# EasyEDA Pro project ProPrj_4进4出_2026-07-01.epro, board PCB1
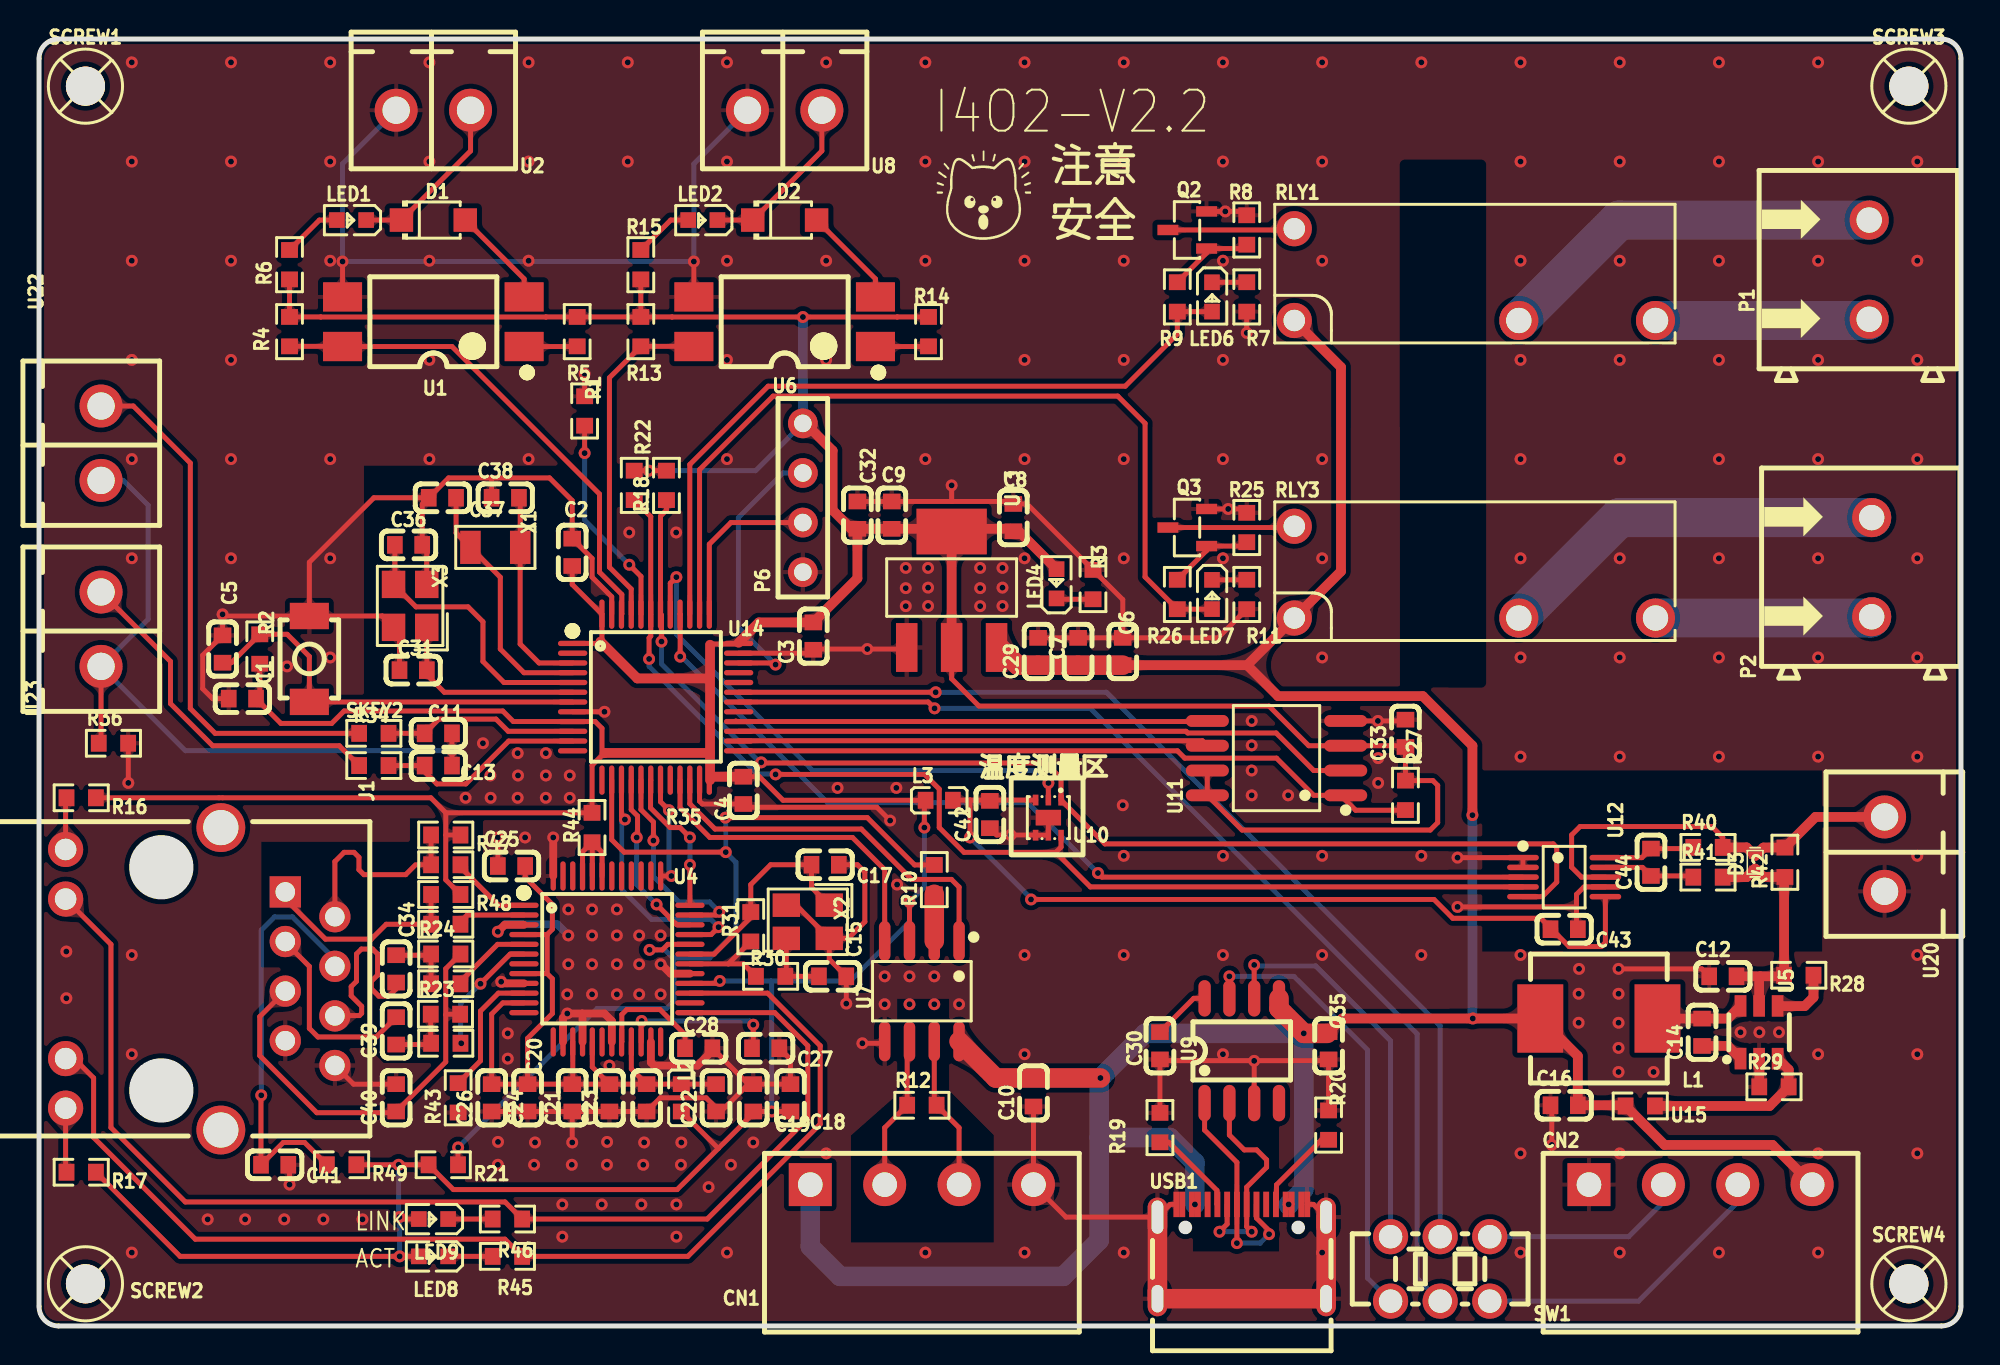
[diagram p3: board, top side]
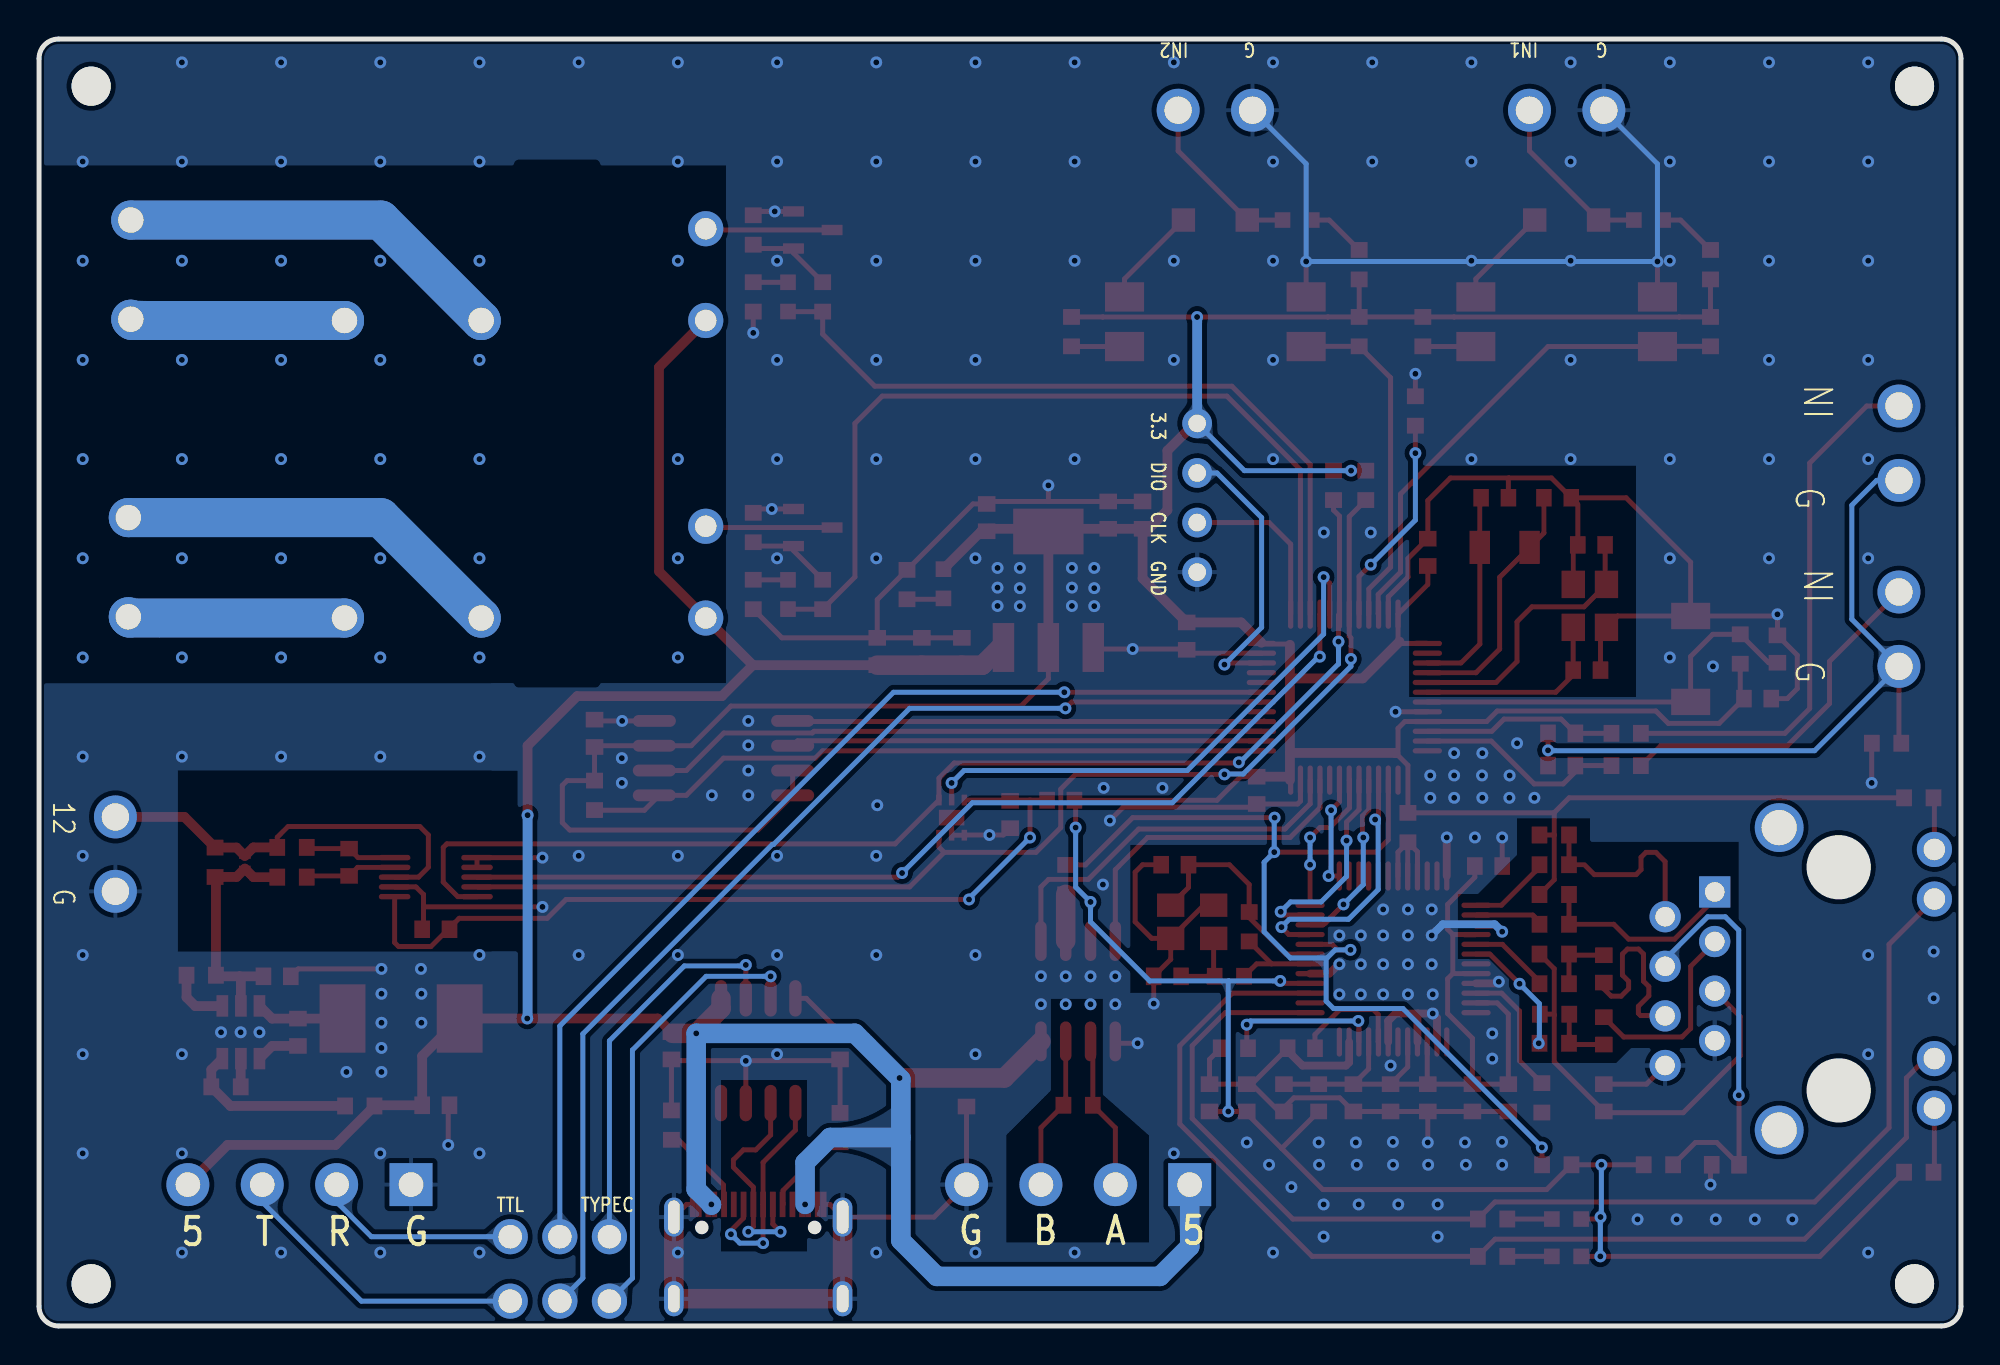
[diagram p4: board, bottom side, seen from below]

Outline 98.42 x 65.91 mm; copper layers: Top Layer, Bottom Layer. Coordinates in mm from the lower left corner of the outline.
Outline path: 0,64.91 0,1 arc(0.29,0.29) 1,0 97.42,0 arc(98.13,0.29) 98.42,1 98.42,64.91 arc(98.13,65.62) 97.42,65.91 1,65.91 arc(0.29,65.62) 0,64.91
Stack: Top Layer 0.035mm / Dielectric1 1.51mm FR4 er 4.5 / Bottom Layer 0.035mm

## Design rules (mm)
net 485_B: DP2
net 485_A: DP2
net TXN: DP3
net TXP: DP3
net RXN: DP4
net RXP: DP4
net $2N96: DP5
net $2N97: DP5
spacing copperThickness1oz (default): track to track 0.102, other pairs 0.152 to 0.3
spacing copperThickness2oz: track to track 0.203, other pairs 0.152 to 0.3
track width copperThickness1oz (default): min 0.127, default 0.254, max 2.54
track width copperThickness2oz: min 0.203, default 0.254, max 2.54
differential pair differentialPair (default): width min 0.127, default 0.254, max 2.54; gap min 0.152, default 0.152
net GND uses copperRegion

## Placement (name value [footprint] x y rotation side)
C1  100nF  [C0603]  10.41 32.13 0 top
C2  100nF  [C0603]  27.3 39.62 270 top
C3  100nF  [C0603]  39.65 35.33 90 top
C4  100nF  [C0603]  36.07 27.43 90 top
C5  100nF  [C0603]  9.4 34.67 270 top
C6  100nF  [C0603]  55.5 34.54 90 top
C7  100nF  [C0603]  53.21 34.54 90 top
C8  100nF  [C0603]  49.89 41.4 270 top
C9  100nF  [C0603]  43.67 41.53 270 top
C10  100nF  [C0603]  50.93 11.94 90 top
C11  100nF  [C0603]  20.45 30.35 0 top
C12  4.7uF  [C0603]  86.23 17.91 0 top
C13  100nF  [C0603]  20.45 28.7 0 top
C14  100nF  [C0603]  85.17 15.04 90 top
C15  18pF  [C0603]  40.64 17.91 180 top
C16  10uF  [C0603]  78.11 11.3 0 top
C17  18pF  [C0603]  40.26 23.62 180 top
C18  100nF  [C0603]  38.48 11.68 270 top
C19  4.7uF  [C0603]  36.58 11.68 270 top
C20  100nF  [C0603]  25.02 11.68 90 top
C21  100nF  [C0603]  29.21 11.68 90 top
C22  100nF  [C0603]  34.67 11.68 90 top
C23  100nF  [C0603]  31.11 11.68 90 top
C24  100nF  [C0603]  27.3 11.68 90 top
C25  100nF  [C0603]  24.2 23.56 0 top
C26  4.7uF  [C0603]  23.18 11.68 90 top
C27  10nF  [C0603]  37.21 14.22 180 top
C28  4.7uF  [C0603]  33.78 14.22 180 top
C29  10uF  [C0603]  51.16 34.54 90 top
C30  100nF  [C0603]  57.4 14.35 270 top
C31  22pF  [C0603]  19.16 33.59 0 top
C32  10uF  [C0603]  41.91 41.53 270 top
C33  100nF  [C0603]  69.98 30.35 90 top
C34  6.8nF  [C0603]  18.29 18.29 270 top
C35  100nF  [C0603]  66.04 14.35 90 top
C36  22pF  [C0603]  18.92 40 180 top
C37  22pF  [C0603]  20.66 42.42 0 top
C38  22pF  [C0603]  23.88 42.42 0 top
C39  6.8nF  [C0603]  18.29 15.11 90 top
C40  10nF  [C0603]  18.29 11.68 90 top
C41  22nF  [C0603]  12.06 8.25 180 top
C42  100nF  [C0603]  48.69 26.19 90 top
C43  100nF  [C0603]  78.11 20.32 180 top
C44  100nF  [C0603]  82.55 23.75 90 top
CN1  WJ15EDGRC-3.81-04P-14-00A  [CONN-TH_WJ15EDGRC-3.81-4P]  45.21 7.24 0 top
CN2  WJ15EDGRC-3.81-04P-14-00A  [CONN-TH_WJ15EDGRC-3.81-4P]  85.09 7.24 0 top
D1  SMF5.0A  [SOD-123FL_L2.7-W1.8-LS3.8-RD]  20.19 56.64 0 top
D2  SMF5.0A  [SOD-123FL_L2.7-W1.8-LS3.8-RD]  38.18 56.64 0 top
D3  H5VL10B  [SOD-882_L1.0-W0.6-BI]  87.88 23.75 90 top
J1  HR911105A  [RJ45-TH_HR911105A]  8.25 17.78 270 top
L1  10uH  [IND-SMD_L7.3-W6.8]  79.88 15.75 180 top
L2  BLM18PG121SN1D  [L0603]  32.89 11.68 90 top
L3  BLM18PG121SN1D  [L0603]  46.1 26.92 0 top
LED1  NCD0603Y2  [LED0603-RD]  16 56.64 180 top
LED2  NCD0603Y2  [LED0603-RD]  33.99 56.64 180 top
LED4  NCD0603Y2  [LED0603-RD]  52.11 38.01 90 top
LED6  NCD0603Y2  [LED0603-RD]  60.07 52.7 270 top
LED7  NCD0603Y2  [LED0603-RD]  60.07 37.47 270 top
LED8  NCD0603Y2  [LED0603-RD]  20.2 3.56 180 top
LED9  NCD0603Y2  [LED0603-RD]  20.2 5.48 180 top
P1  WJ500V-5.08-2P  [CONN-TH_2P-P5.00_WJ500V-5.08-2P]  93.73 54.1 90 top
P2  WJ500V-5.08-2P  [CONN-TH_2P-P5.00_WJ500V-5.08-2P]  93.85 38.86 90 top
P6  4Pin  [4Pin-2.54]  39.12 42.42 90 top
Q2  S8050  [SOT-23-3_L2.9-W1.3-P1.90-LS2.3-BR]  58.8 56.13 0 top
Q3  S8050  [SOT-23-3_L2.9-W1.3-P1.90-LS2.3-BR]  58.8 40.89 0 top
R1  1kΩ  [R0603]  27.94 46.86 90 top
R2  10kΩ  [R0603]  11.3 34.67 270 top
R3  1kΩ  [R0603]  53.98 37.97 270 top
R4  10kΩ  [R0603]  12.83 50.93 90 top
R5  500Ω  [R0603]  27.56 50.93 270 top
R6  1kΩ  [R0603]  12.83 54.36 90 top
R7  1kΩ  [R0603]  61.85 52.7 90 top
R8  10kΩ  [R0603]  61.85 56.13 270 top
R9  1kΩ  [R0603]  58.29 52.7 90 top
R10  10kΩ  [R0603]  45.85 22.86 90 top
R11  1kΩ  [R0603]  61.85 37.47 90 top
R12  120Ω  [R0603]  45.21 11.3 0 top
R13  10kΩ  [R0603]  30.82 50.93 90 top
R14  500Ω  [R0603]  45.55 50.93 270 top
R15  1kΩ  [R0603]  30.82 54.36 90 top
R16  470Ω  [R0603]  2.16 27.05 180 top
R17  470Ω  [R0603]  2.16 7.87 180 top
R18  10kΩ  [R0603]  32.13 43.05 90 top
R19  5.1kΩ  [R0603]  57.4 10.16 90 top
R20  5.1kΩ  [R0603]  66.04 10.29 90 top
R21  10kΩ  [R0603]  20.7 8.25 180 top
R22  10kΩ  [R0603]  30.48 43.05 270 top
R23  50Ω  [R0603]  20.81 15.97 0 top
R24  50Ω  [R0603]  20.83 19.05 0 top
R25  10kΩ  [R0603]  61.85 40.89 270 top
R26  1kΩ  [R0603]  58.29 37.47 90 top
R27  4.7K  [R0603_1]  69.98 27.18 270 top
R28  100kΩ  [R0603]  90.12 17.96 180 top
R29  2.1kΩ  [R0603]  88.85 12.25 0 top
R30  0Ω  [R0603]  37.46 17.91 180 top
R31  1MΩ  [R0603]  36.45 20.45 90 top
R32  0Ω  [R0603]  20.83 23.62 180 top
R33  0Ω  [R0603]  20.83 20.57 180 top
R34  1kΩ  [R0603]  17.14 30.35 180 top
R35  1kΩ  [R0603]  17.14 28.7 180 top
R36  0Ω  [R0603]  3.81 29.84 0 top
R37  0Ω  [R0603]  20.83 17.53 180 top
R38  0Ω  [R0603]  20.83 14.48 180 top
R40  10Ω  [R0603]  85.47 24.51 0 top
R41  10Ω  [R0603]  85.47 22.99 0 top
R42  50mΩ  [R0603]  89.41 23.75 90 top
R43  12.4kΩ  [R0603]  21.46 11.68 90 top
R44  10kΩ  [R0603]  28.32 25.53 270 top
R45  1kΩ  [R0603]  23.99 3.56 180 top
R46  1kΩ  [R0603]  23.99 5.48 180 top
R47  50Ω  [R0603]  20.83 25.15 180 top
R48  50Ω  [R0603]  20.83 22.1 180 top
R49  10Ω  [R0603]  15.49 8.25 180 top
RLY1  G5NB-1A-E-DC5V  [RELAY-TH_G5NB-1A-E-DCXX]  73.53 53.85 0 top
RLY3  G5NB-1A-E-DC5V  [RELAY-TH_G5NB-1A-E-DCXX]  73.53 38.61 0 top
SCREW1  -  [M2螺丝]  2.38 63.5 0 top
SCREW2  -  [M2螺丝]  2.38 2.16 0 top
SCREW3  -  [M2螺丝]  95.76 63.5 0 top
SCREW4  -  [M2螺丝]  95.76 2.16 0 top
SKEY2  TS-1185-B-A-B-A  [SW-SMD_L4.0-W3.0-LS5.0]  13.84 34.16 270 top
SW1  JS202011CQN  [SW-TH_JS202011CQN]  71.76 2.92 180 top
U1  PC817X2CSP9F  [SMD-4_L4.6-W6.5-P2.54-LS10.2-TL]  20.19 51.44 180 top
U2  2P-P3.81_KF2EDGV-3.81-2P  [CONN-TH_2P-P3.81_KF2EDGV-3.81-2P]  20.19 62.27 180 top
U4  W5500  [LQFP-48_L7.0-W7.0-P0.50-LS9.0-BL]  29.08 18.8 270 top
U5  JW5026  [SOT-23-6_L2.9-W1.6-P0.95-LS2.8-BR]  88.09 15.04 270 top
U6  PC817X2CSP9F  [SMD-4_L4.6-W6.5-P2.54-LS10.2-TL]  38.18 51.44 180 top
U7  MAX13487EESA+T  [SOIC-8_L4.9-W3.9-P1.27-LS6.0-BL]  45.21 17.14 180 top
U8  2P-P3.81_KF2EDGV-3.81-2P  [CONN-TH_2P-P3.81_KF2EDGV-3.81-2P]  38.18 62.27 180 top
U9  CH340N  [SOP-8_L4.9-W3.9-P1.27-LS6.0-BL]  61.6 14.1 0 top
U10  STTS22HTR  [DFN-6_L2.0-W2.0-P0.65-BL-EP1.2]  51.69 26.04 180 top
U11  W25Q64JVSSIQ  [SOP-8_L5.3-W5.3-P1.27-LS8.0-BL]  63.37 29.08 90 top
U12  INA226AIDGSR  [MSOP-10_L3.0-W3.0-P0.50-LS5.0-BL]  78.11 22.99 270 top
U13  AMS1117-3.3  [SOT-223-3_L6.5-W3.4-P2.30-LS7.0-BR]  46.74 37.72 270 top
U14  STM32F103C8T6  [LQFP-48_L7.0-W7.0-P0.50-LS9.0-BL]  31.58 32.21 270 top
U15  11.2kΩ  [R0603]  82 11.27 180 top
U20  2P-P3.81_KF2EDGV-3.81-2P  [CONN-TH_2P-P3.81_KF2EDGV-3.81-2P]  94.51 24.17 90 top
U22  2P-P3.81_KF2EDGV-3.81-2P  [CONN-TH_2P-P3.81_KF2EDGV-3.81-2P]  3.17 45.21 270 top
U23  2P-P3.81_KF2EDGV-3.81-2P  [CONN-TH_2P-P3.81_KF2EDGV-3.81-2P]  3.17 35.69 270 top
USB1  typec  [USB-C-SMD_KH-TYPE-C-16P]  61.6 3.81 0 top
X1  32.768kHz  [CRYSTAL-SMD_L3.2-W1.5-1]  23.37 39.88 0 top
X2  25MHz  [CRYSTAL-SMD_4P-L3.2-W2.5-BL]  39.37 20.7 180 top
X3  8MHz  [CRYSTAL-SMD_4P-L3.2-W2.5-BL]  19 36.88 90 top

## Footprints (pads in the part's own frame, mm; a bottom-side part is the same pattern mirrored in y, then rotated)
4Pin-2.54
  round 1.524 hole 0.9: 1(-3.81,0) 2(-1.27,0) 3(1.27,0) 4(3.81,0)
C0603
  rect 0.8x0.9 smd: 1(-0.7,0) 2(0.7,0)
CONN-TH_2P-P3.81_KF2EDGV-3.81-2P
  round 2.2 hole 1.4: 1(-1.905,0) 2(1.905,0)
CONN-TH_2P-P5.00_WJ500V-5.08-2P
  round 2 hole 1.3: 1(-2.54,0) 2(2.54,0)
CONN-TH_WJ15EDGRC-3.81-4P
  rect 2.2x2.2 hole 1.26: 1(-5.715,0)
  round 2.2 hole 1.26: 2(-1.905,0) 3(1.905,0) 4(5.715,0)
CRYSTAL-SMD_4P-L3.2-W2.5-BL
  rect 1.4x1.2 smd: 1(-1.1,-0.85) 2(1.1,-0.85) 3(1.1,0.85) 4(-1.1,0.85)
CRYSTAL-SMD_L3.2-W1.5-1
  rect 1.05x1.7 smd: 1(-1.275,0) 2(1.275,0)
DFN-6_L2.0-W2.0-P0.65-BL-EP1.2
  rect 0.28x0.55 smd: 1(-0.65,-0.9) 2(0.001,-0.9) 3(0.65,-0.9) 4(0.65,0.9) 5(0,0.9) 6(-0.65,0.9)
  rect 1.3x0.8 smd: 7(0.001,0)
IND-SMD_L7.3-W6.8
  rect 2.35x3.5 smd: 1(-3,0) 2(3,0)
L0603
  rect 0.8x0.864 smd: 1(-0.7,0) 2(0.7,0)
LED0603-RD
  rect 0.8x0.8 smd: 1(-0.749,0) 2(0.749,0)
LQFP-48_L7.0-W7.0-P0.50-LS9.0-BL
  oval 0.27x1.5 smd: 1(-2.75,-4.25) 2(-2.25,-4.25) 3(-1.75,-4.25) 4(-1.25,-4.25) 5(-0.75,-4.25) 6(-0.25,-4.25) 7(0.25,-4.25) 8(0.75,-4.25) 9(1.25,-4.25) 10(1.75,-4.25) 11(2.25,-4.25) 12(2.75,-4.25) 25(2.75,4.25) 26(2.25,4.25) 27(1.75,4.25) 28(1.25,4.25) 29(0.75,4.25) 30(0.25,4.25) 31(-0.25,4.25) 32(-0.75,4.25) 33(-1.25,4.25) 34(-1.75,4.25) 35(-2.25,4.25) 36(-2.75,4.25)
  oval 1.5x0.27 smd: 13(4.25,-2.75) 14(4.25,-2.25) 15(4.25,-1.75) 16(4.25,-1.25) 17(4.25,-0.75) 18(4.25,-0.25) 19(4.25,0.25) 20(4.25,0.75) 21(4.25,1.25) 22(4.25,1.75) 23(4.25,2.25) 24(4.25,2.75) 37(-4.25,2.75) 38(-4.25,2.25) 39(-4.25,1.75) 40(-4.25,1.25) 41(-4.25,0.75) 42(-4.25,0.25) 43(-4.25,-0.25) 44(-4.25,-0.75) 45(-4.25,-1.25) 46(-4.25,-1.75) 47(-4.25,-2.25) 48(-4.25,-2.75)
M2螺丝
  round 2 hole 2: 1(0,0)
MSOP-10_L3.0-W3.0-P0.50-LS5.0-BL
  oval 0.28x1.62 smd: 1(-1,-2.11) 2(-0.5,-2.11) 3(0,-2.11) 4(0.5,-2.11) 5(1,-2.11) 6(1,2.11) 7(0.5,2.11) 8(0,2.11) 9(-0.5,2.11) 10(-1,2.11)
R0603
  rect 0.806x0.864 smd: 1(-0.753,0) 2(0.753,0)
R0603_1
  rect 0.806x0.864 smd: 1(-0.753,0) 2(0.753,0)
RELAY-TH_G5NB-1A-E-DCXX
  round 1.8 hole 1.1: 1(-9.25,-2.35) 4(-9.25,2.35)
  round 2 hole 1.3: 2(2.25,-2.35) 3(9.25,-2.35)
RJ45-TH_HR911105A
  rect 1.6x1.6 hole 1: 1(-4.45,4.355)
  round 1.6 hole 1: 2(-3.18,6.895) 3(-1.91,4.355) 4(-0.64,6.895) 5(0.63,4.355) 6(1.9,6.895) 7(3.17,4.355) 8(4.44,6.895)
  round 1.8 hole 1.1: 9(-6.625,-6.895) 10(-4.085,-6.895) 11(4.085,-6.895) 12(6.625,-6.895)
  round 2.5 hole 1.8: SH1(-7.745,1.055) SH2(7.745,1.055)
SMD-4_L4.6-W6.5-P2.54-LS10.2-TL
  rect 2x1.5 smd: 1(-4.65,1.27) 2(-4.65,-1.27) 3(4.65,-1.27) 4(4.65,1.27)
SOD-123FL_L2.7-W1.8-LS3.8-RD
  rect 1.2x1.2 smd: 1(-1.635,0) 2(1.635,0)
SOD-882_L1.0-W0.6-BI
  rect 0.3x0.6 smd: 1(-0.325,0) 2(0.325,0)
SOIC-8_L4.9-W3.9-P1.27-LS6.0-BL
  oval 0.588x2.045 smd: 1(-1.905,-2.57) 2(-0.635,-2.57) 3(0.635,-2.57) 4(1.905,-2.57) 5(1.905,2.57) 6(0.635,2.57) 7(-0.635,2.57) 8(-1.905,2.57)
SOP-8_L4.9-W3.9-P1.27-LS6.0-BL
  oval 0.63x1.865 smd: 1(-1.905,-2.683) 2(-0.635,-2.683) 3(0.635,-2.683) 4(1.905,-2.683) 5(1.905,2.683) 6(0.635,2.683) 7(-0.635,2.683) 8(-1.905,2.683)
SOP-8_L5.3-W5.3-P1.27-LS8.0-BL
  oval 0.609x2.204 smd: 1(-1.905,-3.542) 2(-0.635,-3.542) 3(0.635,-3.542) 4(1.905,-3.542) 5(1.905,3.542) 6(0.635,3.542) 7(-0.635,3.542) 8(-1.905,3.542)
SOT-23-3_L2.9-W1.3-P1.90-LS2.3-BR
  rect 1.07x0.532 smd: 1(0.99,-0.95) 2(0.99,0.95) 3(-0.99,0)
SOT-23-6_L2.9-W1.6-P0.95-LS2.8-BR
  rect 1.1x0.6 smd: 1(1.35,-0.95) 2(1.35,0) 3(1.35,0.95) 4(-1.35,0.95) 5(-1.35,0) 6(-1.35,-0.95)
SOT-223-3_L6.5-W3.4-P2.30-LS7.0-BR
  rect 2.5x1.1 smd: 1(2.97,-2.3) 2(2.97,0) 3(2.97,2.3)
  rect 2.34x3.6 smd: 4(-2.97,0)
SW-SMD_L4.0-W3.0-LS5.0
  rect 1.35x2 smd: 1(-2.2,0) 2(2.2,0)
SW-TH_JS202011CQN
  round 1.8 hole 1.2: 1(-2.54,-1.65) 2(0,-1.65) 3(2.54,-1.65) 4(-2.54,1.65) 5(0,1.65) 6(2.54,1.65)
USB-C-SMD_KH-TYPE-C-16P
  oval 1x2 hole 0.6x1.7: 1(-4.32,1.765) 2(4.32,1.765)
  oval 1x1.8 hole 0.6x1.4: 3(-4.32,-2.415) 4(4.32,-2.415)
  rect 0.3x1.3 smd: A1(-3.35,2.415) A4(-2.55,2.415) A5(-1.25,2.415) A6(-0.25,2.415) A7(0.25,2.415) A8(1.25,2.415) A9(2.55,2.415) A12(3.35,2.415) B1(3.05,2.415) B4(2.25,2.415) B5(1.75,2.415) B6(0.75,2.415) B7(-0.75,2.415) B8(-1.75,2.415) B9(-2.25,2.415) B12(-3.05,2.415)

## Nets
As in the schematic, except:
VCC3.3: C1.2 C2.2 C3.2 C4.2 C8.2 C9.2 C18.2 C19.2 C32.2 C33.1 L2.1 L3.1 LED4.2 LED8.2 LED9.2 P6.4 R2.2 R4.2 R5.1 R6.1 R13.2 R14.1 R15.1 R16.1 R17.1 R18.2 R21.2 R22.1 R27.1 R44.1 R47.1 R48.1 R49.1 U4.28 U7.3 U11.3 U11.7 U11.8 U13.2 U13.4 U14.1 U14.9 U14.24 U14.36 U14.48
$2N103: J1.9 R16.2
$2N104: J1.12 R17.2

Pads without a net: J1 SH1 SH2; SCREW1 1; SCREW2 1; SCREW3 1; SCREW4 1; U4 7 12 13 18 24 26 38 39 40 41 42 46 47; U9 4; U14 20; USB1 A8 B8

## Via types
v1: diameter 0.61, hole 0.305, Top Layer to Bottom Layer, 328 vias

## Routing (per net, layer and track width the routed paths; a pad name or vN(x,y) marks a point on that pad's centre or on a via; arc(x,y) is an arc through that point)
12V: length 21.7
  Top Layer w0.254: U12.8 78.99,22.99 78.49,23.5 78.49,25.15 78.92,25.58 85.67,25.58 86.22,25.03 R40.2 ; 91.06,25.99 90.98,26.07
  Top Layer w0.5: U20.2 90.98,26.07 R42.2 88.31,24.5 D3.2 87.45,24.51 R40.2
+5V: length 158.4
  Top Layer w0.5: 61.87,33.84 63.45,32.26 70.87,32.26 73.41,29.72 v1(73.41,26.16) ; 61.87,33.84 C6.1 ; 61.87,33.84 RLY3.1 66.67,38.65 66.67,49.11 RLY1.1 ; CN2.4 88.77,9.27 83.24,9.27 U15.2 81.21,11.3 C16.2 78.8,13.83 L1.2 v1(73.42,15.75) 66.74,15.75 C35.2
  Top Layer w1: 65.98,14.99 v1(64.77,14.99) 63.5,16.26 U9.5 ; 49.13,34.82 50.11,33.84 C29.1 C7.1 C6.1 ; U7.8 48.99,12.7 v1(54.36,12.7)
  Bottom Layer w0.5: v1(73.41,26.16) 73.41,15.75
  Bottom Layer w1: 54.29,9.65 54.29,12.63 56.64,14.99 v1(64.77,14.99) 64.77,7 v1(63.99,6.22) 63.99,6.18 ; 54.29,9.65 54.29,4.38 52.45,2.54 41.02,2.54 39.5,4.06 CN1.1 ; 54.29,9.65 57.91,9.65 59.2,8.37 v1(59.2,6.22)
AGND: length 37.5
  Top Layer w0.254: C11.2 v1(21.15,29.48) C13.2 ; U23.2 3.17,29.96 R36.1
  Bottom Layer w0.254: U22.2 4.32,43.31 5.59,42.04 5.59,36.19 U23.2 7.49,29.46 21.08,29.46
GND: length 287.2
  Top Layer w0.254: X2.4 41.44,19.85 42.29,20.7 42.29,23.24 41.91,23.62 C17.1 ; X2.4 40.47,18.78 C15.1 v1(41.34,16.51) ; X2.4 38.77,21.55 X2.2 ; 9.4,36.32 9.44,36.36 SKEY2.1 ; 9.4,36.32 C5.1 8.38,34.36 8.38,32.64 8.89,32.13 C1.1 ; 9.4,36.32 v1(9.4,36.45) ; C24.1 C20.1 C26.1 ; C24.1 C21.1 C23.1 31.82,11.68 34.16,11.68 34.67,11.18 C22.1 34.92,10.98 36.32,12.38 ; C24.1 v1(27.3,9.4) ; 62.24,13.59 v1(62.23,13.58) U9.3 ; 62.24,13.59 57.47,13.59 C30.2 R19.2 ; 62.24,13.59 65.98,13.59 C35.1 R20.2 ; C37.1 19.62,42.08 C36.1 19.85,39.77 X3.2 ; C37.1 20.97,43.43 23.16,43.43 ; C37.1 17.14,42.42 13.84,39.12 SKEY2.1 ; 46.75,42.23 46.74,42.24 v1(46.74,43.05) ; 46.75,42.23 C9.1 C32.1 ; 46.75,42.23 49.77,42.23 C8.1 50.6,42.1 R3.1 55.5,37.2 C6.2 ; 36.32,12.38 C28.1 ; 36.32,12.38 C19.1 C18.1 38.48,13.65 C27.1 ; SKEY2.1 17.57,36.36 X3.4 18.46,35.47 C31.1 ; 23.16,43.43 26.14,43.43 27.3,42.27 C2.1 28.32,39.31 28.32,38.35 29.33,37.35 U14.47 ; 23.16,43.43 23.18,43.42 C38.1 ; 78.74,21.46 78.74,22.1 79.12,22.49 U12.7 ; 78.74,21.46 v1(72.64,21.46) ; 78.74,21.46 78.74,20.39 C43.1 ; U6.3 v1(33.53,54.52) ; U12.2 U12.1 v1(72.64,23.99) ; R36.2 4.57,29.84 v1(4.57,27.81) ; U14.23 33.83,26.88 33.97,26.73 C4.1 36.23,26.57 42.9,26.57 v1(43.58,25.89) ; U10.5 U10.4 51.03,25.15 v1(49.75,25.15) 49.04,25.15 C42.1 ; R8.1 61.65,57.08 v1(60.75,57.08) Q2.2 ; R25.1 61.65,41.84 v1(60.9,41.84) 59.79,41.84 ; C6.2 C7.2 C29.2 ; C6.2 60.38,35.24 R11.1 ; C10.1 CN1.4 52.59,5.57 USB1.1 57.92,6.22 58.24,6.22 ; J1.8 16.11,12.38 C40.2 ; U14.8 v1(28.96,31.46) ; U13.1 44.36,34.67 v1(42.42,34.67) 39.69,34.67 C3.1 39.48,34.46 U14.35 ; R7.1 v1(61.85,50.86) ; C12.1 85.15,18.29 v1(80.89,18.29) ; U7.5 43.21,14.48 v1(42.16,14.48) ; 15.54,52.7 v1(15.54,54.52) ; 77.4,11.3 77.47,11.24 v1(77.47,9.27) ; USB1.A12 65.27,6.22 USB1.2 ; C25.1 v1(23.5,25.02) ; v1(12.83,7.24) 12.83,8.19 C41.1 ; R1.2 v1(27.94,48.77) ; C33.2 69.91,30.99 v1(68.57,30.99) U11.4 ; U10.7 51.69,25.14
  Top Layer w0.4: 27.81,16 28.96,16 29.33,15.62 U4.19 ; 27.81,16 27.83,15.98 U4.16 ; 27.81,16 v1(27.05,16) 26.83,15.78 U4.14 ; U4.29 32.34,18.05 31.91,18.48 ; v1(23.67,17.63) 23.75,17.55 24.83,17.55 ; C28.1 34.48,14.1 33.72,13.34 31.5,13.34 31.33,13.5 U4.23 ; v1(23.5,20.19) 23.85,20.55 24.83,20.55 ; U4.48 v1(26.33,25.02)
  Top Layer w0.5: U5.2 88.1,13.68 R29.1
  Top Layer w1: USB1.1 USB1.3 USB1.4 USB1.2
  Bottom Layer w0.254: U8.2 33.53,59.52 v1(33.53,54.52) v1(15.54,54.52) 15.54,59.52 U2.2
  Bottom Layer w0.4: v1(23.5,20.19) 23.88,20.57 26.54,20.57 27.1,20.01 v1(27.1,20)
  vias: v1(1.4,19.18) v1(1.4,16.78) v1(4.75,64.72) v1(4.75,59.64) v1(4.75,54.56) v1(4.75,49.48) v1(4.75,44.4) v1(4.75,39.32) v1(4.75,19) v1(4.75,13.92) v1(4.75,3.76) v1(8.64,5.46) v1(9.83,64.72) v1(9.83,59.64) v1(9.83,54.56) v1(9.83,49.48) v1(9.83,44.4) v1(9.83,39.32) v1(10.55,5.46) v1(12.56,5.46) v1(12.7,33.78) v1(14.56,5.46) v1(14.91,64.72) v1(14.91,59.64) v1(14.91,54.56) v1(14.91,44.4) v1(14.91,39.32) v1(14.91,34.24) v1(16.56,5.46) v1(19.99,64.72) v1(19.99,59.64) v1(19.99,54.56) v1(19.99,49.48) v1(19.99,44.4) v1(21.84,27.05) v1(22.73,29.84) v1(23.11,28.19) v1(23.13,27.05) v1(23.5,9.43) v1(23.5,8.25) v1(24,14.99) v1(24,13.69) v1(24.51,29.34) v1(24.53,28.19) v1(24.51,27.05) v1(24.89,25.02) v1(25.07,64.72) v1(25.07,59.64) v1(25.07,54.56) v1(25.07,44.4) v1(25.4,9.4) v1(25.35,8.25) v1(25.96,29.34) v1(25.96,28.19) v1(25.95,27.05) v1(26.8,6.22) v1(26.8,4.57) v1(27.1,21.34) v1(27.1,18.53) v1(27.05,16.98) v1(27.18,28.19) v1(27.18,27.05) v1(27.28,8.25) v1(28.32,21.34) v1(28.32,20) v1(28.32,18.53) v1(28.32,16.98) v1(28.82,6.22) v1(29.09,9.43) v1(29.08,8.25) v1(29.21,13.34) v1(29.59,21.34) v1(29.59,20) v1(29.59,18.53) v1(29.59,16.98) v1(30.15,64.72) v1(30.15,59.64) v1(30.23,40.64) v1(30.73,20) v1(30.73,18.53) v1(30.73,16.98) v1(30.85,6.22) v1(30.99,9.4) v1(30.94,8.25) v1(31.83,20) v1(31.83,18.53) v1(31.83,16.98) v1(32.63,40.64) v1(32.64,6.22) v1(32.64,4.57) v1(32.89,9.4) v1(32.87,8.25) v1(34.29,7.11) v1(35.23,64.72) v1(35.23,59.64) v1(35.23,54.56) v1(35.23,49.48) v1(35.23,44.4) v1(35.23,3.76) v1(35.43,8.25) v1(36.58,9.4) v1(40.31,64.72) v1(40.31,54.56) v1(40.31,49.48) v1(40.31,8.84) v1(40.89,27.56) v1(43.31,17.91) v1(43.31,16.48) v1(43.9,27.56) v1(43.94,22.61) v1(44.39,38.83) v1(44.39,37.79) v1(44.39,36.87) v1(44.58,17.91) v1(44.58,16.48) v1(45.39,64.72) v1(45.39,59.64) v1(45.39,54.56) v1(45.39,44.4) v1(45.39,3.76) v1(45.53,38.83) v1(45.53,37.82) v1(45.53,36.88) v1(45.85,17.91) v1(45.85,16.48) v1(47.12,17.91) v1(47.12,16.48) v1(48.2,38.83) v1(48.2,37.79) v1(48.2,36.87) v1(49.34,38.83) v1(49.34,37.82) v1(49.34,36.88) v1(50.47,64.72) v1(50.47,59.64) v1(50.47,54.56) v1(50.47,49.48) v1(50.47,44.4) v1(50.47,39.32) v1(50.47,19) v1(50.47,13.92) v1(50.47,3.76) v1(55.5,26.67) v1(55.55,64.72) v1(55.55,59.64) v1(55.55,54.56) v1(55.55,49.48) v1(55.55,44.4) v1(55.55,39.32) v1(55.55,24.08) v1(55.55,19) v1(55.55,3.76) v1(60.63,64.72) v1(60.63,59.64) v1(60.63,54.56) v1(60.63,49.48) v1(60.63,44.4) v1(60.63,39.32) v1(60.63,24.08) v1(60.63,19) v1(60.63,13.92) v1(62.1,30.99) v1(62.1,29.74) v1(62.1,28.45) v1(62.1,27.18) v1(63.97,27.18) v1(65.71,64.72) v1(65.71,59.64) v1(65.71,54.56) v1(65.71,44.4) v1(65.71,39.32) v1(65.71,34.24) v1(65.71,24.08) v1(65.71,19) v1(65.71,3.76) v1(68.58,29.08) v1(68.58,27.81) v1(70.79,64.72) v1(70.79,24.08) v1(70.79,19) v1(75.87,64.72) v1(75.87,59.64) v1(75.87,54.56) v1(75.87,49.48) v1(75.87,44.4) v1(75.87,39.32) v1(75.87,34.24) v1(75.87,29.16) v1(75.87,19) v1(75.87,8.84) v1(75.87,3.76) v1(78.87,18.29) v1(78.84,17.01) v1(78.84,15.53) v1(80.89,17.01) v1(80.89,15.53) v1(80.89,14.24) v1(80.89,13.01) v1(80.95,64.72) v1(80.95,59.64) v1(80.95,54.56) v1(80.95,49.48) v1(80.95,44.4) v1(80.95,39.32) v1(80.95,34.24) v1(80.95,29.16) v1(80.95,8.84) v1(80.95,3.76) v1(82.68,13.01) v1(86.03,64.72) v1(86.03,59.64) v1(86.03,54.56) v1(86.03,49.48) v1(86.03,44.4) v1(86.03,39.32) v1(86.03,34.24) v1(86.03,29.16) v1(86.03,3.76) v1(87.14,15.04) v1(88.1,15.04) v1(89.11,15.04) v1(91.11,64.72) v1(91.11,59.64) v1(91.11,54.56) v1(91.11,49.48) v1(91.11,44.4) v1(91.11,39.32) v1(91.11,34.24) v1(91.11,29.16) v1(91.11,13.92) v1(91.11,8.84) v1(91.11,3.76) v1(96.19,59.64) v1(96.19,54.56) v1(96.19,49.48) v1(96.19,44.4) v1(96.19,39.32) v1(96.19,34.24) v1(96.19,29.16) v1(96.19,24.08) v1(96.19,19) v1(96.19,13.92) v1(96.19,8.84)
VCC3.3: length 304.6
  Top Layer w0.254: 28.83,29.48 28.83,30.61 28.48,30.96 U14.9 24.29,30.96 23.75,31.5 15.62,31.5 14.99,30.86 12.38,30.86 C1.2 11.3,32.32 R2.2 ; R14.1 43.95,51.68 43.95,51.68 v1(39.12,51.68) 32.42,51.68 32.42,51.68 R13.2 ; U13.2 46.74,33.15 48.13,31.75 62.99,31.75 65.02,29.72 U11.3 69.91,29.72 C33.1 R27.1 71.38,27.93 71.63,27.69 71.63,25.78 71.25,25.4 61.61,25.4 U11.8 U11.7 ; LED8.2 v1(18.47,3.56) 7.22,3.56 R17.1 ; 20.83,25.15 20.83,22.85 R48.1 ; 20.83,25.15 21.58,25.15 ; 20.83,25.15 20.83,26.29 ; R16.1 9.22,27.05 arc(9.31,27.05) 9.41,27.05 20.07,27.05 20.83,26.29 ; C2.2 27.3,37.98 U14.48 28.83,35.2 28.59,34.96 U14.1 ; C18.2 v1(37.52,10.98) C19.2 36.58,10.88 34.8,9.1 ; v1(45.34,25.53) 45.34,26.86 45.4,26.92 38.1,26.92 36.89,28.13 C4.2 ; R18.2 v1(31.23,43.81) R22.1 ; v1(18.46,5.58) 18.56,5.48 LED9.2 ; 28.96,29.35 28.32,28.71 R44.1 20.84,26.28 20.83,26.29 ; 34.8,9.1 34.77,9.1 L2.1 ; 34.8,9.1 32.68,6.98 21.22,6.98 R21.2 v1(18.42,8.25) R49.1 ; R6.1 R4.2 14.42,51.68 14.43,51.68 25.96,51.68 25.96,51.68 R5.1 R13.2 ; R15.1 R13.2 ; v1(34.86,17.67) 34.74,17.55 U4.28 ; U7.3 v1(44.58,21.72) ; 35.79,34.92 34.33,34.92
  Top Layer w0.5: C32.2 C9.2 49.77,40.83 C8.2 50.17,40.7 52.11,38.76 ; C32.2 41.91,40.83 41.6,40.83 40.64,41.78 40.64,44.83 39.24,46.23 P6.4 ; C32.2 41.91,38.29 C3.2 36.87,36.03 35.83,34.99 ; C4.2 34.5,28.13 ; 34.36,34.89 34.36,29.35 ; 34.36,29.35 28.96,29.35 28.96,29.34 ; 34.36,29.35 34.36,27.96 ; 28.75,35.05 30.64,33.17 34.33,33.17 ; U13.2 U13.4
  Bottom Layer w0.254: 37.5,17.67 37.52,17.65 v1(37.52,10.98) ; 37.5,17.67 v1(34.86,17.67) ; 37.5,17.67 41.55,17.67 44.58,20.7 v1(44.58,21.72) 45.34,22.48 v1(45.34,25.53) ; v1(18.42,8.25) 18.42,5.62 v1(18.46,5.58) 18.47,5.57 v1(18.47,3.56) ; P6.4 36.69,43.81 v1(31.23,43.81)
  Bottom Layer w0.5: P6.4 39.12,51.56
3.3A: length 38.6
  Top Layer w0.254: U4.21 30.33,13.17 C23.2 ; C24.2 27.33,12.41 U4.15 ; C24.2 C20.2 ; C24.2 C21.2 ; 24.83,20.05 26.02,20.05 ; 26.02,20.05 26.29,20.32 26.29,21.59 24.89,22.98 24.89,23.28 ; 26.02,20.05 26.02,20.04 26.02,18.17 ; U4.17 28.33,13.26 C21.2 ; C20.2 C26.2 ; C20.2 25.02,14.73 26.29,16 26.29,17.78 26.02,18.05 24.83,18.05 ; C21.2 C23.2 ; C23.2 L2.2 C22.2 ; 23.18,12.45 23.18,15.98 23.75,16.55 24.83,16.55
485_A: length 7.9
  Top Layer w0.254: U7.6 44.46,14.46 R12.1 43.31,10.15 CN1.2
485_B: length 7.9
  Top Layer w0.254: U7.7 45.85,11.42 R12.2 47.12,10.15 CN1.3
ACTLED: length 59.2
  Top Layer w0.254: J1.11 1.8,13.69 2.79,12.7 2.79,9.65 8,4.44 23.86,4.44 R45.1 33.23,3.56 40.01,10.34 40.01,14.35 37.31,17.05 U4.27
D+: length 11.5
  Top Layer w0.254: USB1.B6 62.35,5.53 62.99,4.88 v1(62.99,4.7) ; U9.1 59.69,10.03 61.35,8.38 USB1.A6 v1(61.35,4.24)
  Bottom Layer w0.254: v1(61.35,4.24) 62.54,4.24 v1(62.99,4.7)
D-: length 11.5
  Top Layer w0.254: v1(62.1,4.83) 61.85,5.08 USB1.A7 61.85,7.11 62.86,8.13 62.86,8.51 62.36,9.02 61.72,9.02 60.96,9.78 U9.2 ; v1(60.45,4.83) 60.85,5.22 USB1.B7
  Bottom Layer w0.254: v1(60.45,4.83) v1(62.1,4.83)
IIC1_SCL: length 62.7
  Top Layer w0.254: R18.1 32.13,41.78 31.83,41.48 U14.42 31.88,36.41 v1(31.88,35.05) ; U12.5 76.98,21.99 77.72,22.73 77.72,24.51 77.54,24.69 54.58,24.69 U10.1 52.34,28.05 51.56,28.83 36.95,28.83
  Bottom Layer w0.254: v1(31.88,35.05) 31.88,33.91 36.95,28.83
  vias: v1(36.98,28.87)
IIC1_SDA: length 60.4
  Top Layer w0.254: 52.07,24.26 52.34,24.53 52.34,25.01 ; 52.07,24.26 47.37,24.26 46.1,25.53 46.1,27.5 45.35,28.25 v1(37.72,28.25) ; 52.07,24.26 53.84,22.49 U12.4 ; R22.2 31.33,41.45 U14.43 31.33,35.33 31.24,35.24 v1(31.24,34.16)
  Bottom Layer w0.254: v1(37.72,28.25) 37.7,28.27 36.75,28.27 31.24,33.78 v1(31.24,34.16)
IIC-A-3.3: length 43.4
  Top Layer w0.254: 47.68,26.94 v1(47.68,25.02) ; 47.68,26.94 46.81,26.94 L3.2 ; 47.68,26.94 U10.3 ; v1(50.8,21.84) 71.44,21.84 72.4,20.88 76.91,20.88 77.4,20.39 ; 77.47,20.32 78.36,19.43 80.01,19.43 80.21,19.64 U12.6
  Bottom Layer w0.254: v1(47.68,25.02) 50.8,21.89 v1(50.8,21.84)
IN1: length 8.9
  Top Layer w0.254: 16.75,56.64 D1.1 22.1,60.18 U2.1
IN2: length 8.9
  Top Layer w0.254: LED2.1 D2.1 40.09,60.18 U8.1
INTN: length 7.5
  Top Layer w0.254: 33.33,21.55 v1(33.33,23.62) ; v1(33.33,25.02) 32.83,25.53 32.32,25.53 31.32,26.53 31.32,27.95 31.33,27.96
  Bottom Layer w0.254: v1(33.33,23.62) v1(33.33,25.02)
LINKLED: length 62.9
  Top Layer w0.254: U4.25 37.67,16.05 39.37,14.35 39.37,10.63 34.22,5.48 R46.1 23.87,6.35 7.49,6.35 3.68,10.16 3.68,19.54 J1.10
MISO: length 9.1
  Top Layer w0.254: U14.16 30.33,26.44 30.65,26.12 30.65,25.06 v1(30.61,25.02) ; U4.34 32.67,20.55 32.58,20.63 32.55,20.63 32.3,20.87 32.3,20.91 v1(31.62,21.59)
  Bottom Layer w0.254: v1(30.61,25.02) 30.61,22.61 v1(31.62,21.59)
MOSI: length 10.9
  Top Layer w0.254: U4.35 34.67,21.05 v1(34.84,21.21) ; v1(31.46,24.86) 31.46,25.81 30.83,26.45 U14.17
  Bottom Layer w0.254: v1(34.84,21.21) 34.33,21.72 32.77,21.72 31.46,23.02 v1(31.46,24.86)
NRST: length 21.3
  Top Layer w0.254: C5.2 9.85,33.97 R2.1 12.71,35.42 13.84,34.29 SKEY2.2 13.85,31.96 U14.7
PA0: length 10
  Top Layer w0.254: U14.10 24.03,30.46 23.4,31.08 20.48,31.08 C11.1 R34.1
PA1: length 10.9
  Top Layer w0.254: R35.1 C13.1 19.75,28.39 20.37,27.76 21.85,27.76 24.05,29.96 U14.11
PA4: length 51.5
  Top Layer w0.254: v1(35.17,24.27) 29.96,24.27 29.33,24.9 U14.14 ; v1(31.26,19.26) 31.92,19.26 32.2,19.55 U4.32 ; R21.1 21.45,9.14 v1(21.46,9.14) ; R10.2 44.84,23.61 42.42,26.03 v1(35.15,26.03)
  Bottom Layer w0.254: v1(31.26,19.26) 32.05,19.26 32.46,18.85 34.34,18.85 35.69,20.19 35.69,23.75 v1(35.17,24.27) 35.17,26.02 v1(35.15,26.03) ; v1(21.46,9.14) 28.58,16.26 32.13,16.26 32.51,16.64 32.51,18.8
PA5: length 13.1
  Top Layer w0.254: U4.33 34.42,20.05 v1(34.8,20.43) ; v1(30,25.94) 29.83,26.12 U14.15
  Bottom Layer w0.254: v1(34.8,20.43) 34.4,20.83 31.37,20.83 29.85,22.35 29.85,25.78 v1(30,25.94)
PA9: length 56
  Top Layer w0.254: U14.30 45.54,31.96 v1(45.86,31.63)
  Bottom Layer w0.254: SW1.5 70.58,2.45 70.58,14.96 60.87,24.66 60.81,24.66 53.84,31.63 v1(45.86,31.63)
PA10: length 53.8
  Top Layer w0.254: v1(45.92,32.46) U14.31
  Bottom Layer w0.254: v1(45.92,32.46) 54.67,32.46 71.76,15.37 SW1.2
PA15: length 44.3
  Top Layer w0.254: U14.38 33.83,43.86 37.59,47.62 55.24,47.62 56.64,46.23 56.64,38.36 R26.1 60.07,36.71 60.07,36.72
PB1: length 5.7
  Top Layer w0.254: U14.19 31.83,26.85 v1(32.26,26.42) ; U4.37 v1(32.39,23.05)
  Bottom Layer w0.254: v1(32.26,26.42) 32.26,23.17 v1(32.39,23.05)
PB3: length 38.3
  Top Layer w0.254: U14.39 33.33,44.12 37.34,48.13 55.63,48.13 58.29,50.8 R9.1 60.07,51.95 LED6.2
PB4: length 50
  Top Layer w0.254: U12.3 54.44,22.99 v1(54.23,23.2) ; U14.40 32.83,36.45 v1(32.83,34.28)
  Bottom Layer w0.254: v1(32.83,34.28) 32.9,34.28 40.39,26.8 50.63,26.8 v1(54.23,23.2)
PB5: length 28.2
  Top Layer w0.254: v1(32.64,38.35) 32.33,38.04 U14.41 ; v1(51.69,27.81) 51.69,26.81 51.69,26.81
  Bottom Layer w0.254: v1(32.64,38.35) 32.64,35.43 39.62,28.45 51.05,28.45 v1(51.69,27.81)
PB8: length 17.6
  Top Layer w0.254: U14.45 30.33,37.75 29.21,38.86 29.21,48.56 R13.1 33.53,50.17 U6.4
PB9: length 25.6
  Top Layer w0.254: U14.46 29.85,36.48 29.85,37.47 28.7,38.61 28.7,42.61 21.14,50.16 15.54,50.16 15.53,50.17 R4.1
PB10: length 16.9
  Top Layer w0.254: U14.21 32.83,26.55 34.35,25.02 41.66,25.02 43.31,23.37 U7.4
PB11: length 19.5
  Top Layer w0.254: U7.1 47.12,22.48 46.72,22.87 44.69,22.87 42.11,25.45 34.62,25.45 33.33,26.74 U14.22
PB12: length 35.4
  Top Layer w0.254: 66.85,26.98 67.43,26.41 69.97,26.41 ; U14.25 58.3,29.46 58.67,29.08 63.37,29.08 65.28,27.18 U11.1
PB13: length 24.1
  Top Layer w0.254: U11.6 59.58,29.97 35.84,29.97 U14.26
PB14: length 31.9
  Top Layer w0.254: U11.2 65.28,28.45 63.36,30.37 58.82,30.37 58.74,30.46 U14.27
PB15: length 24
  Top Layer w0.254: 35.69,30.99 35.72,30.96 59.67,30.96 59.7,30.99
POWER_IN: length 12.6
  Top Layer w0.5: R41.2 87.45,22.99 D3.1 88.31,23 R42.1 89.37,22.95 R28.2 89.31,17.91 88.15,17.91 ; C12.2 88.15,17.91 ; 88.15,17.91 88.09,17.85 U5.5
RXN: length 3.2
  Top Layer w0.254: R37.2 R24.1 20.01,18.99 ; C34.1 19.89,18.99
RXP: length 3.2
  Top Layer w0.254: C39.1 19.88,14.41 ; R23.1 20.06,14.49 R38.2 20.01,14.41
SWCLK: length 8.8
  Top Layer w0.254: P6.2 35.43,41.15 34.33,40.04 U14.37
SWDIO: length 14.5
  Top Layer w0.254: U14.34 37.64,33.96 v1(37.72,33.87)
  Bottom Layer w0.254: v1(37.72,33.87) 35.81,35.78 35.81,41.4 38.1,43.69 P6.3
TTL_RX: length 9.6
  Bottom Layer w0.254: 83.18,6.35 81.41,4.57 SW1.1
TTL_TX: length 15.7
  Bottom Layer w0.254: SW1.4 81.92,1.27 86.99,6.35 CN2.3
TXN: length 10.4
  Top Layer w0.254: 19.41,23.62 R32.2 R47.2 ; 19.28,23.62 18.77,23.11 16.64,23.11 16.38,23.37 16.38,24 16.13,24.26 15.62,24.26 15.15,23.79 15.15,20.96
TXP: length 10.4
  Top Layer w0.254: J1.1 12.61,21.87 14.67,19.81 17.02,19.81 17.78,20.57 19.95,20.57 ; R48.2 R33.2
TYPEC-RX: length 23.1
  Top Layer w0.254: U9.7 v1(60.96,17.91)
  Bottom Layer w0.254: v1(60.96,17.91) 64.26,17.91 68.04,14.13 68.04,2.45 SW1.6
TYPEC-TX: length 20.3
  Top Layer w0.254: U9.6 62.23,18.44
  Bottom Layer w0.254: SW1.3 69.21,14.61 65.38,18.44 62.23,18.44
  vias: v1(62.23,18.49)
XTALA: length 14.5
  Top Layer w0.254: C36.2 18.22,38.05 X3.3 19.3,36.83 21.97,36.83 22.73,36.07 22.73,34.04 23.81,32.96 U14.5
XTALB: length 10.3
  Top Layer w0.254: U14.6 20.76,32.46 19.86,33.35 C31.2 19.86,35.78 X3.1
XTALC: length 10.6
  Top Layer w0.254: U14.3 25.61,33.96 24.64,34.92 24.64,39.87 X1.2 24.64,42.35 C38.2
XTALD: length 12.9
  Top Layer w0.254: C37.2 21.36,40.61 X1.1 23.62,38.35 23.62,34.67 24.84,33.46 U14.4
$1N367: length 4.6
  Top Layer w0.254: USB1.B5 63.37,6.25 63.37,7.23 65.68,9.53 R20.1
$1N370: length 4.7
  Top Layer w0.254: R19.1 57.86,9.41 60.33,6.94 60.33,6.25 USB1.A5
$1N388: length 3
  Top Layer w0.254: U9.8 59.13,16.78 C30.1
$1N491: length 10.8
  Top Layer w0.254: v1(27.94,44.7) R1.1 ; v1(30.23,38.99) 30.83,38.39 U14.44
  Bottom Layer w0.254: v1(27.94,44.7) 27.94,41.28 v1(30.23,38.99)
$1N546: length 1.9
  Top Layer w0.254: LED4.1 52.15,37.22 R3.2
$1N558: length 2.7
  Top Layer w0.254: R5.2 27.55,50.16 U1.1
$1N561: length 3.1
  Top Layer w0.254: R6.2 14.36,56.64 LED1.2
$1N563: length 5.2
  Top Layer w0.254: D1.2 24.84,53.63 U1.2
$1N574: length 20.1
  Bottom Layer w2: RLY1.2 80.93,56.64 P1.2
$1N576: length 4.5
  Top Layer w0.254: R8.2 61.65,55.18 Q2.1 59.79,54.96 R9.2
$1N586: length 2.4
  Top Layer w1: U7.2 R10.1
$1N625: length 5.2
  Top Layer w0.254: D2.2 42.83,53.63 U6.2
$1N627: length 3.1
  Top Layer w0.254: LED2.2 32.35,56.64 R15.2
$1N628: length 2.7
  Top Layer w0.254: R14.2 45.54,50.16 U6.1
$1N654: length 11
  Bottom Layer w2: P1.1 93.66,51.5 RLY1.3
$1N655: length 11.1
  Bottom Layer w2: RLY3.3 93.79,36.26 93.85,36.32
$1N656: length 20.2
  Bottom Layer w2: P2.2 80.93,41.4 RLY3.2
$1N658: length 4.5
  Top Layer w0.254: R26.2 59.79,39.72 Q3.1 61.65,39.94 R25.2
$1N660: length 6.5
  Top Layer w0.254: Q3.3 64.22,40.89 RLY3.4
$1N687: length 6.5
  Top Layer w0.254: RLY1.4 64.22,56.13 Q2.3
$1N688: length 1.8
  Top Layer w0.254: LED6.1 61.84,53.45 R7.2
$1N691: length 1.8
  Top Layer w0.254: LED7.1 61.84,38.21 R11.2
$1N700: length 27.5
  Top Layer w0.254: U22.1 4.83,47.12 7.75,44.2 7.75,31.62 9.02,30.35 R34.2
$1N708: length 18.2
  Top Layer w0.254: R35.2 15.38,29.72 8.89,29.72 6.73,31.88 6.73,34.04 U23.1
$1N758: length 8.9
  Top Layer w0.5: U5.3 89.6,13.13 R29.2 88.62,11.27 U15.1
$1N759: length 4.5
  Top Layer w0.5: L1.1 82.89,15.74 C14.2 86.49,15.74 U5.6
$1N760: length 2.2
  Top Layer w0.5: C14.1 86.49,14.34 U5.1
$1N761: length 3.2
  Top Layer w0.5: U5.4 89.05,16.38 90.42,16.38 90.87,16.83 R28.1
$2N2: length 5.3
  Top Layer w0.254: R30.2 36.07,18.55 35.3,18.55 ; 35.3,18.55 R31.1 ; 35.3,18.55 U4.30
$2N7: length 11.6
  Top Layer w0.254: U4.31 34.57,19.05 36.45,20.92 R31.2 36.45,22.61 37.46,23.62 C17.2 39.56,22.46 X2.1
$2N11: length 3.7
  Top Layer w0.254: C15.2 R30.1 38.27,17.96 X2.3
$2N23: length 5.6
  Top Layer w0.254: R44.2 27.83,24.29 U4.45 ; U4.43 28.83,24.26 28.33,24.76 U4.44
$2N27: length 4.2
  Top Layer w0.254: 24.83,21.55 23.53,21.55 21.45,23.62
$2N28: length 3.6
  Top Layer w0.254: 24.83,21.05 21.93,21.05 21.45,20.57
$2N29: length 4
  Top Layer w0.254: 21.58,17.64 23.48,19.55 24.83,19.55
$2N30: length 6.3
  Top Layer w0.254: 24.83,19.05 24.13,19.05 v1(22.61,17.53)
  Bottom Layer w0.254: 21.59,14.48 21.59,16.51 v1(22.61,17.53)
  vias: v1(21.62,14.48)
$2N48: length 6.8
  Top Layer w0.254: 24.83,17.05 23.52,17.05 22.61,16.13 22.61,13.58 R43.2
$2N51: length 8.1
  Top Layer w0.254: v1(36.58,15.43) 36.58,14.29 C27.2 ; v1(30.86,15.62) 30.83,15.59 U4.22
  Bottom Layer w0.254: v1(36.58,15.43) 36.39,15.62 v1(30.86,15.62)
$2N52: length 6
  Top Layer w0.254: U4.20 29.85,14.56 29.85,15.95 30.1,16.2 31.8,16.2 33.08,14.92 C28.2
$2N79: length 2.3
  Top Layer w0.254: R45.2 LED8.1
$2N82: length 2.3
  Top Layer w0.254: R46.2 LED9.1
$2N96: length 10
  Top Layer w0.254: C34.2 18.29,17.27 17.91,16.89 17.4,16.89 17.02,17.27 17.02,17.65 17.34,17.97 17.34,19.05 17.08,19.3 16.51,19.3 16.26,19.05 16.26,17.65 15.98,17.38 15.98,16.91 16.52,16.37 16.52,16.01 16.41,15.9 15.17,15.9 J1.6 ; 18.54,17.53 18.54,17.59
$2N97: length 10
  Top Layer w0.254: J1.3 12.61,19.65 13.84,18.41 13.84,15.24 14.28,14.8 17.28,14.8 C39.2
$2N103: length 2.7
  Top Layer w0.254: R16.2 1.36,27.01 J1.9
$2N104: length 3.3
  Top Layer w0.254: R17.2 1.36,7.92 J1.12
$2N112: length 21.7
  Top Layer w0.254: v1(11.38,11.81) 11.36,11.8 C41.2 12.51,9.4 13.6,9.4 R49.2
  Bottom Layer w0.254: v1(11.38,11.81) 11.38,20.27 12.06,20.95 12.97,20.95 15.15,18.78 J1.4
$2N122: length 22.3
  Top Layer w0.254: R24.2 20.83,18.3 20.83,15.93 ; 20.83,15.93 20.83,13.52 C40.1 18.29,10.92 14.22,10.92 11.3,13.84 11.3,15.84 J1.5 ; 20.83,15.93 20.86,15.97 R23.2
$3N26: length 4.7
  Top Layer w0.254: R41.1 84.66,23.05 C44.1 82.11,23.49 U12.9
$3N27: length 4.7
  Top Layer w0.254: R40.1 84.66,24.45 C44.2 82.09,23.99 U12.10

## Copper pours and planes (outline as drawn; the poured copper is in the pictures)
GND on Top Layer: -4.57,71.88 101.85,71.88 101.85,-6.48 -4.57,-6.48
GND on Top Layer: -31.88,46.1 72.26,46.1 72.26,-18.29 -31.88,-18.29
GND on Bottom Layer: -29.72,46.1 75.31,46.1 75.31,-18.29 -29.72,-18.29
GND on Bottom Layer: -2.29,69.22 103.76,69.22 103.76,-6.1 -2.29,-6.1

Small or netless copper shapes (teardrops, artwork), in the pictures only: 623 on Top Layer, 88 on Bottom Layer

## Text on the board
Bottom Silkscreen Layer: TYPEC | TTL | 3.3 | DIO | CLK | GND | G | IN1 | IN2 | 12 | IN | 5 | A | B | R | T
Top Silkscreen Layer: LINK | ACT | I4O2-V2.2 | 温度测量区 | 注意 / 安全
